# Altium schematic sheet VGA.SchDoc: Evaluation Board 3.2
size A3; Organization: Toradex AG; Address1: Altsagenstrasse 5; Address2: Horw; Address3: 6048; Address4: Switzerland; DocumentNumber: 14; Revision: V3.2; SheetNumber: 14; SheetTotal: 23; PageSetup: Record=PageOptions|CenterHorizontal=True|CenterVertical=True|PrintScale=0.73|XCorrection=1.00|YCorrection=1.00|PrintKind=0|BorderSize=5000000|LeftOffset=0|BottomOffset=0|Orientation=2|PaperLength=1000|PaperWidth=1000|Scale=100|PaperSource=7|PrintQuality=-4|MediaType=1|DitherType=10|PaperKind=A4|PrintScaleMode=1
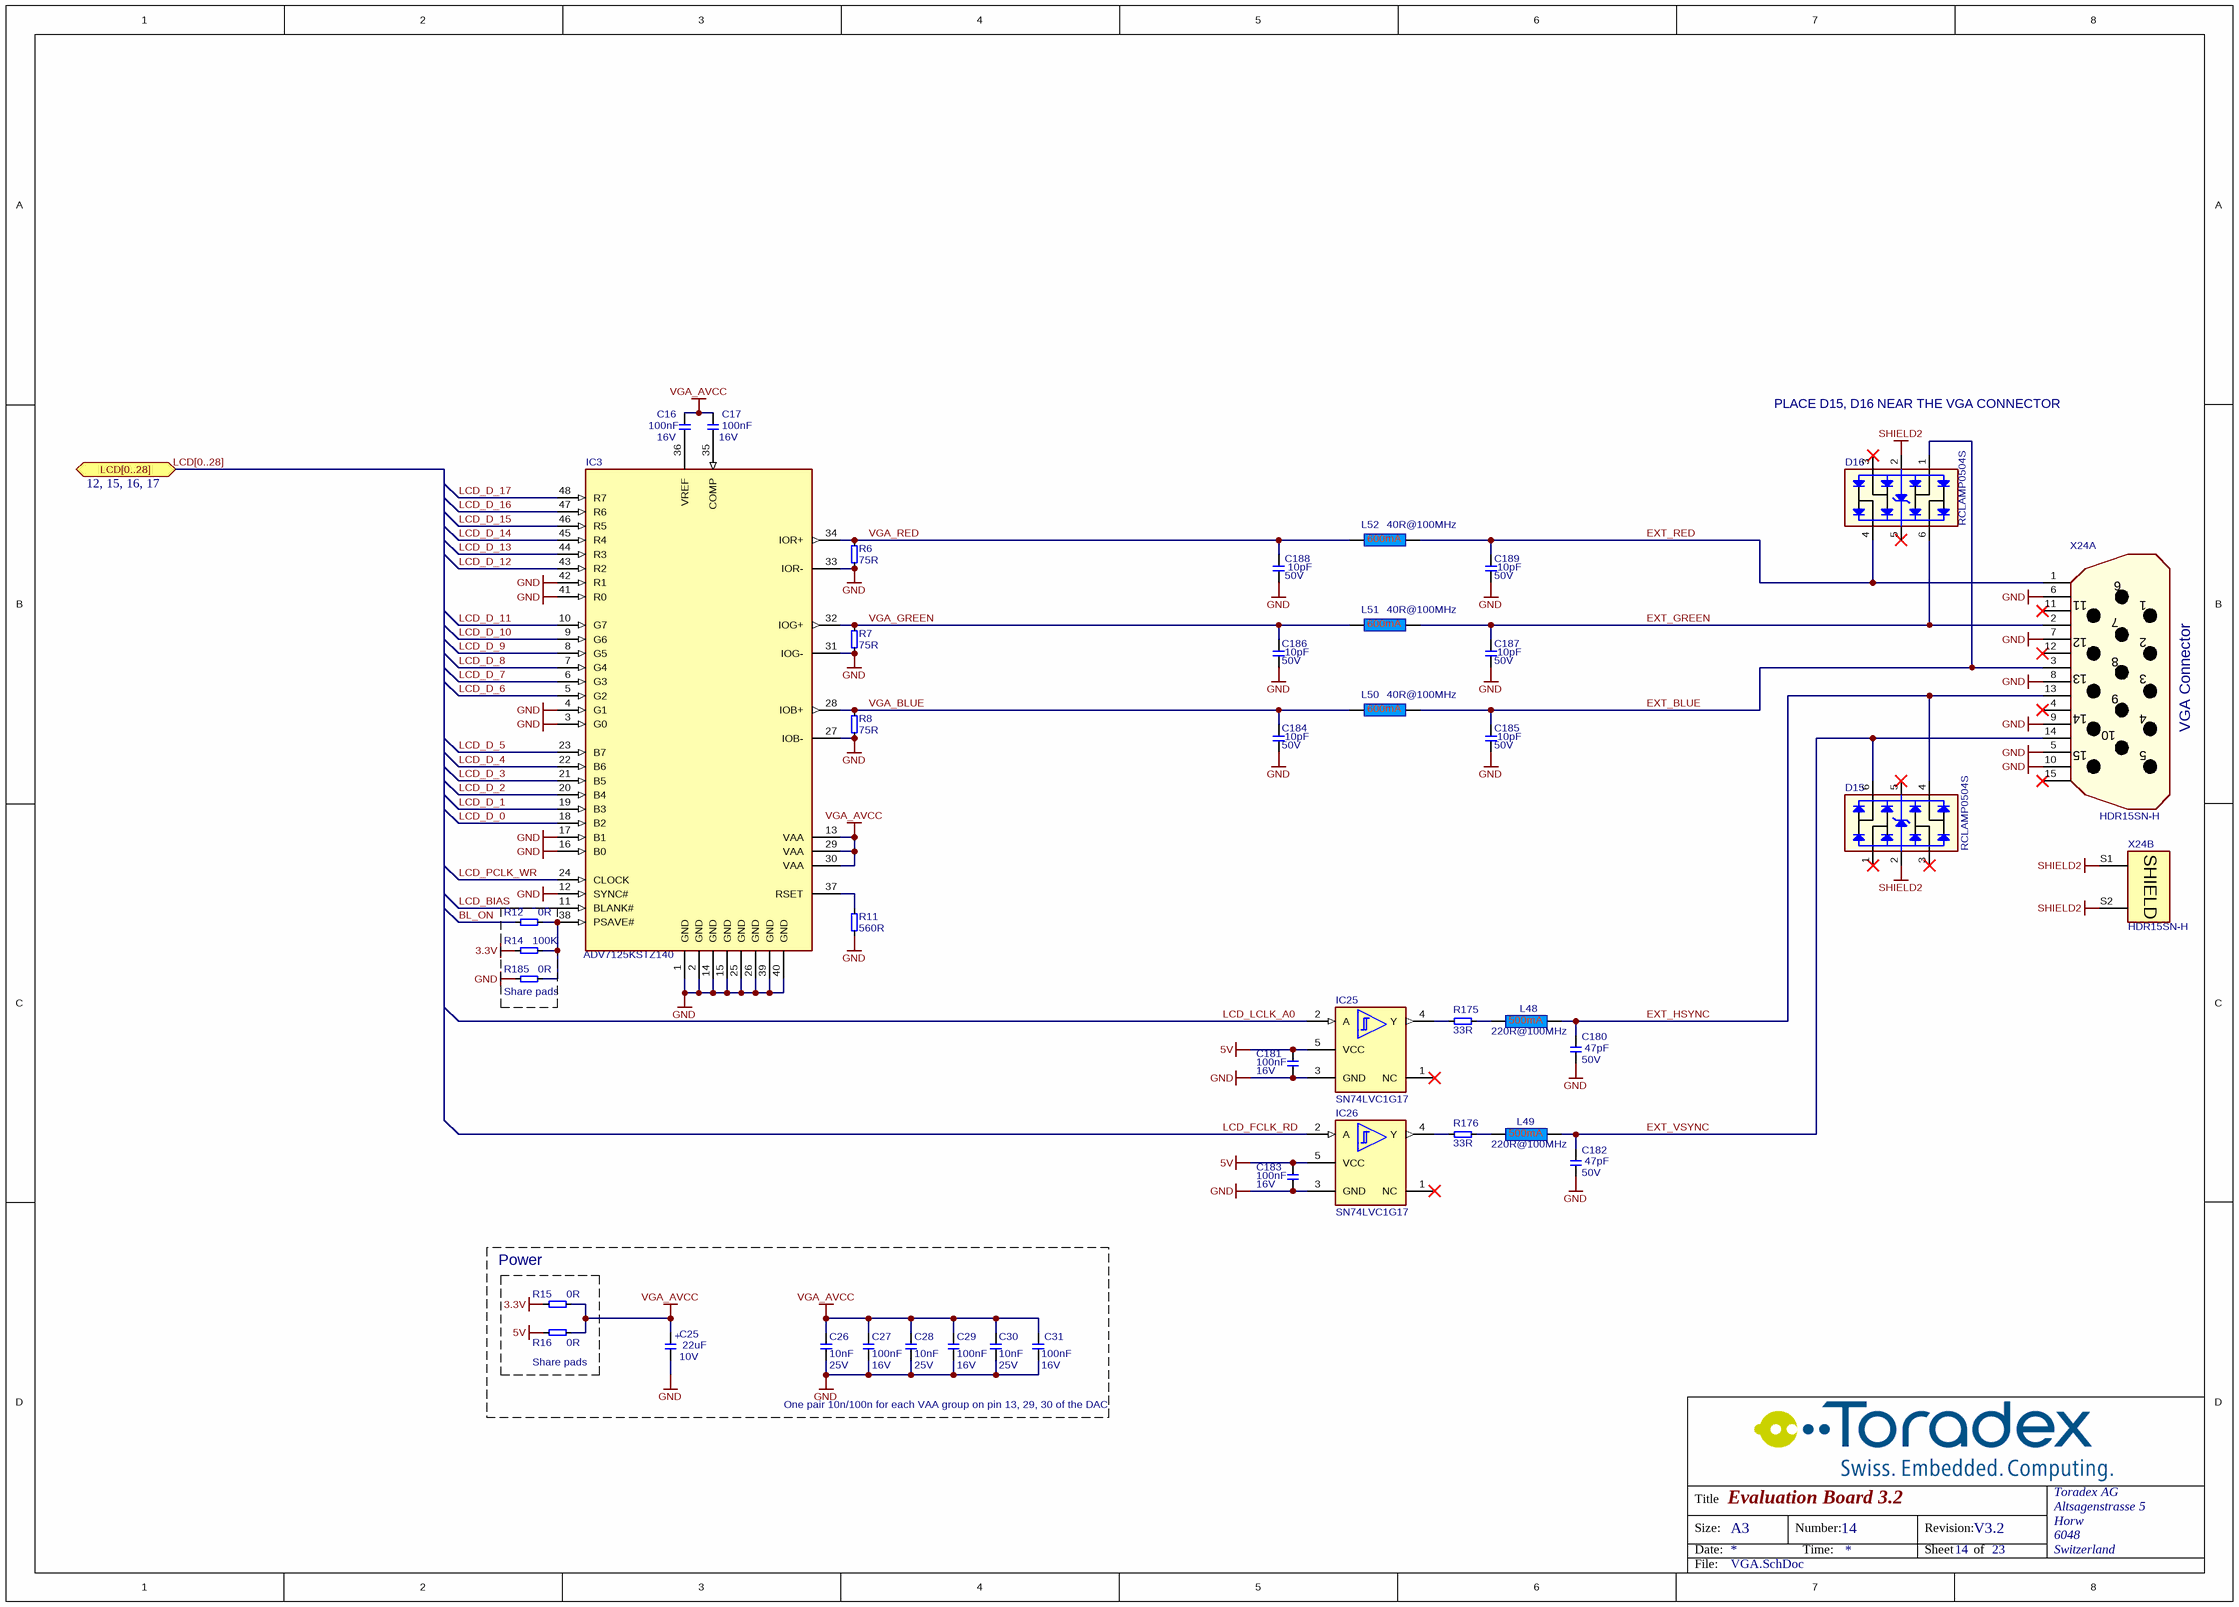
[diagram p0: VGA.SchDoc]

## Parts
C16  Rating: 16V  [T_CAPC0603X33N]  (hidden comment: 100nF)
C17  Rating: 16V  [T_CAPC0603X33N]  (hidden comment: 100nF)
C25  Rating: 10V  [CAPMP3528X210N]  (hidden comment: 22uF)
C26  Rating: 25V  [T_CAPC0603X33N]  (hidden comment: 10nF)
C27  Rating: 16V  [T_CAPC0603X33N]  (hidden comment: 100nF)
C28  Rating: 25V  [T_CAPC0603X33N]  (hidden comment: 10nF)
C29  Rating: 16V  [T_CAPC0603X33N]  (hidden comment: 100nF)
C30  Rating: 25V  [T_CAPC0603X33N]  (hidden comment: 10nF)
C31  Rating: 16V  [T_CAPC0603X33N]  (hidden comment: 100nF)
C180  Rating: 50V  [T_CAPC0603X33N]  (hidden comment: 47pF)
C181  Rating: 16V  [T_CAPC0603X33N]  (hidden comment: 100nF)
C182  Rating: 50V  [T_CAPC0603X33N]  (hidden comment: 47pF)
C183  Rating: 16V  [T_CAPC0603X33N]  (hidden comment: 100nF)
C184  Rating: 50V  [T_CAPC0603X33N]  (hidden comment: 10pF)
C185  Rating: 50V  [T_CAPC0603X33N]  (hidden comment: 10pF)
C186  Rating: 50V  [T_CAPC0603X33N]  (hidden comment: 10pF)
C187  Rating: 50V  [T_CAPC0603X33N]  (hidden comment: 10pF)
C188  Rating: 50V  [T_CAPC0603X33N]  (hidden comment: 10pF)
C189  Rating: 50V  [T_CAPC0603X33N]  (hidden comment: 10pF)
D15  RCLAMP0504S  [T_SOT95P285X90-6N]
D16  RCLAMP0504S  [T_SOT95P285X90-6N]
IC3  ADV7125KSTZ140  [QFP50P900X900X120-48N]
IC25  SN74LVC1G17  [SOT65P210X110-5N]
IC26  SN74LVC1G17  [SOT65P210X110-5N]
L48  220R@100MHz  [INDC1608X95N]
L49  220R@100MHz  [INDC1608X95N]
L50  40R@100MHz  [INDC1608X95N]
L51  40R@100MHz  [INDC1608X95N]
L52  40R@100MHz  [INDC1608X95N]
R6  75R  [T_RESC0603X30N]
R7  75R  [T_RESC0603X30N]
R8  75R  [T_RESC0603X30N]
R11  560R  [t_RESC0603X30N]
R12  0R  [T_RESC0603X30N]
R14  100K  [T_RESC0603X30N]
R15  0R  [T_RESC0603X30N]
R16  0R  [T_RESC0603X30N]
R175  33R  [t_RESC0603X30N]
R176  33R  [t_RESC0603X30N]
R185  0R  [t_RESC0603X30N]
X24  HDR15SN-H  [T_AUK_HDR15SN-H]  (parts A,B of 2)

## Blocks framed on the sheet
Share pads: R12 R14 R185
Share pads: C25-C31
Power: R15 R16

## Ports
LCD[0..28] (bidir, see 12, 15, 16, 17)

## Nets
3.3V: R14.1 R15.1
5V: C181.2 C183.2 IC25.5(VCC) IC26.5(VCC) R16.1
GND: C25.2 C26.1 C27.1 C28.1 C29.1 C30.1 C31.1 C180.2 C181.1 C182.2 C183.1 C184.2 C185.2 C186.2 C187.2 C188.2 C189.2 IC3.1(GND) IC3.2(GND) IC3.3(G0) IC3.4(G1) IC3.12(SYNC#) IC3.14(GND) IC3.15(GND) IC3.16(B0) IC3.17(B1) IC3.25(GND) IC3.26(GND) IC3.27(IOB-) IC3.31(IOG-) IC3.33(IOR-) IC3.39(GND) IC3.40(GND) IC3.41(R0) IC3.42(R1) IC25.3(GND) IC26.3(GND) R6.1 R7.1 R8.1 R11.1 R185.1 X24.5(GND) X24.6(DSR) X24.7(RTS) X24.8(CTS) X24.9(RI) X24.10(RI)
SHIELD2: D15.2 D16.2 X24.S1(SHIELD) X24.S2(SHIELD)
VGA_AVCC: C16.1 C17.1 C25.1 C26.2 C27.2 C28.2 C29.2 C30.2 C31.2 IC3.13(VAA) IC3.29(VAA) IC3.30(VAA) R15.2 R16.2
BL_ON: R12.1
EXT_BLUE: C185.1 D16.1 L50.2 X24.3(TXD)
EXT_GREEN: C187.1 D16.6 L51.2 X24.2(RXD)
EXT_HSYNC: C180.1 D15.4 L48.2 X24.13(RI)
EXT_RED: C189.1 D16.4 L52.2 X24.1(DCD)
EXT_VSYNC: C182.1 D15.6 L49.2 X24.14(RI)
LCD_BIAS: IC3.11(BLANK#)
LCD_D_0: IC3.18(B2)
LCD_D_1: IC3.19(B3)
LCD_D_2: IC3.20(B4)
LCD_D_3: IC3.21(B5)
LCD_D_4: IC3.22(B6)
LCD_D_5: IC3.23(B7)
LCD_D_6: IC3.5(G2)
LCD_D_7: IC3.6(G3)
LCD_D_8: IC3.7(G4)
LCD_D_9: IC3.8(G5)
LCD_D_10: IC3.9(G6)
LCD_D_11: IC3.10(G7)
LCD_D_12: IC3.43(R2)
LCD_D_13: IC3.44(R3)
LCD_D_14: IC3.45(R4)
LCD_D_15: IC3.46(R5)
LCD_D_16: IC3.47(R6)
LCD_D_17: IC3.48(R7)
LCD_FCLK_RD: IC26.2(A)
LCD_LCLK_A0: IC25.2(A)
LCD_PCLK_WR: IC3.24(CLOCK)
VGA_BLUE: C184.1 IC3.28(IOB+) L50.1 R8.2
VGA_GREEN: C186.1 IC3.32(IOG+) L51.1 R7.2
VGA_RED: C188.1 IC3.34(IOR+) L52.1 R6.2
NetC16_2: C16.2 IC3.36(VREF)
NetC17_2: C17.2 IC3.35(COMP)
NetIC3_37: IC3.37(RSET) R11.2
NetIC3_38: IC3.38(PSAVE#) R12.2 R14.2 R185.2
NetIC25_4: IC25.4(Y) R175.1
NetIC26_4: IC26.4(Y) R176.1
NetL48_1: L48.1 R175.2
NetL49_1: L49.1 R176.2

Not connected (* = marked no-connect by the designer): D15 1* 3* 5*; D16 3* 5*; IC25 1(NC)*; IC26 1(NC)*; X24 4(DTR)* 11(RI)* 12(RI)* 15(RI)*

## Buses and harness runs
bus LCD[0..28]

## Notes on the sheet
- (near D16) PLACE D15, D16 NEAR THE VGA CONNECTOR
- VGA Connector
- One pair 10n/100n for each VAA group on pin 13, 29, 30 of the DAC
- Labels drawn without touching a wire or pin: LCD[0..28]
- Title
- Size:
- Date:
- A3
- Number:
- Time:
- Revision:
- Sheet
- of
- File:
- (in symbol C-TA-22uF-10V-20%-3528) +

## Library data of the parts
C16 C17 C27 C29 C31 C181 C183 = C-X7R-100nF-16V-10%-0603: Capacitor Ceramic X7R 100nF 16V 10% 0603; Tolerance: 10%; Type: X7R; Value: 100nF
C25 = C-TA-22uF-10V-20%-3528: Capacitor TA 22uF 10V 20% 3528; Tolerance: 20%; Type: TA; Value: 22uF
C26 C28 C30 = C-X7R-10nF-25V-10%-0603: Capacitor Ceramic X7R 10nF 25V 10% 0603; Tolerance: 10%; Type: X7R; Value: 10nF
C180 C182 = C-NP0-47pF-50V-10%-0603: Capacitor Ceramic NP0 47pF 50V 10% 0603; Tolerance: 10%; Type: NP0; Value: 47pF
C184-C189 = C-NP0-10pF-50V-10%-0603: Capacitor Ceramic NP0 10pF 50V 10% 0603; Tolerance: 10%; Type: NP0; Value: 10pF
D15 D16 = D-Semtech-RClamp0504S: TVS Array low cap; Manufacturer Name: Semtech; Manufacturer Part No.: RCLAMP0504S
IC3 = IC-AD-ADV7125KSTZ140: Video DAC 8bit 140MHz; Manufacturer Name: Analog Devices; Manufacturer Part No.: ADV7125KSTZ140
IC25 IC26 = IC-TI-SN74LVC1G17: Single Schmitt-Trigger Buffer; Manufacturer Name: Texas Instruments; Manufacturer Part No.: SN74LVC1G17
L48 L49 = L-220R@100MHz-500mA-25%-0603: 220R@100MHz 500mA EMI FILTER; Tolerance: 25%; Rating: 500mA; Value: 220R@100MHz
L50-L52 = L-TDK-MMZ1608S400A-40R@100MHz-600mA-25%-0603: 40R@100MHz 600mA EMI FILTER; Manufacturer Name: TDK; Tolerance: 25%; Rating: 600mA; Manufacturer Part No.: MMZ1608S400A; Value: 40R@100MHz
R6-R8 = R-75R-63mW-1%-0603: Resistor 75 ohm 63mW 1% 0603; Rating: 63mW; Tolerance: 1%; Value: 75R
R11 = R-560R-63mW-5%-0603: Resistor 560 ohm 63mW 5% 0603; Rating: 63mW; Tolerance: 5%; Value: 560R
R12 R15 R16 R185 = R-0R-63mW-1%-0603: Resistor 0 ohm 63mW 1% 0603; Rating: 63mW; Tolerance: 1%; Value: 0R
R14 = R-100KR-63mW-5%-0603: Resistor 100 Kohm 63mW 5% 0603; Value: 100KR; Rating: 63mW; Tolerance: 5%
R175 R176 = R-33R-63mW-5%-0603: Resistor 33 ohm 63mW 5% 0603; Rating: 63mW; Tolerance: 5%; Value: 33R
X24 = CON-AUK-HDR15SN-H: 15 pin male D-SUB connector; Manufacturer Name: AUK; No. of ways: 15; Manufacturer Part No.: HDR15SN-H